# Altium schematic sheet [1]_schematic_Block.SchDoc
size A; SheetNumber: 1; SheetTotal: 11
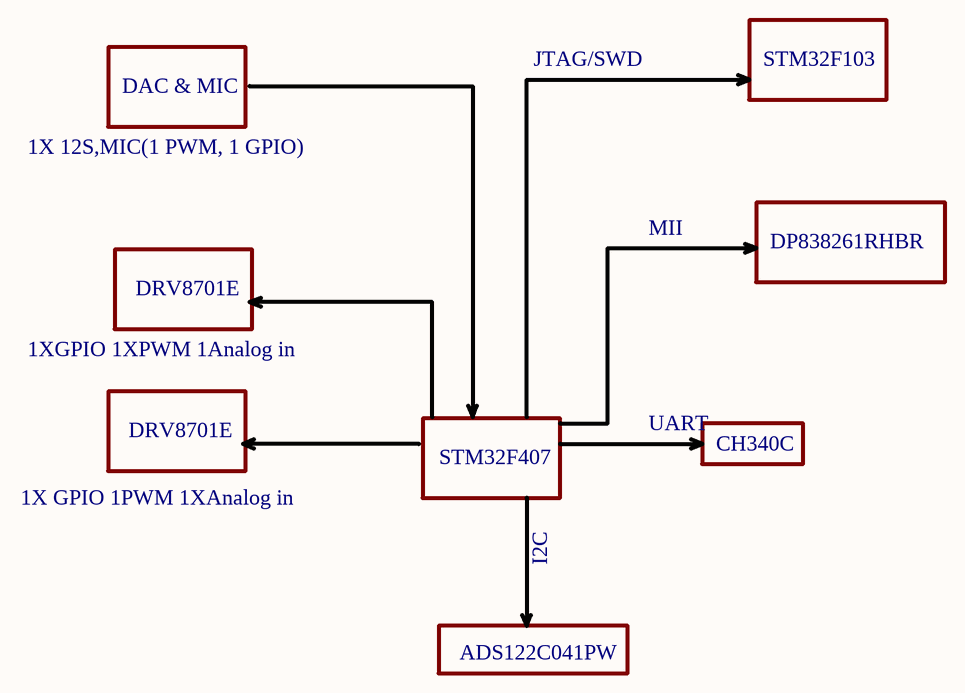
[diagram p0: [1]_schematic_Block.SchDoc]

## Notes on the sheet
- JTAG/SWD
- STM32F103
- DAC & MIC
- 1X 12S,MIC(1 PWM, 1 GPIO)
- MII
- DP838261RHBR
- DRV8701E
- 1XGPIO 1XPWM 1Analog in
- STM32F407
- UART
- CH340C
- 1X GPIO 1PWM 1XAnalog in
- I2C
- ADS122C041PW